# EAGLE design EspWifiMk2 (EAGLE 8.0.0)
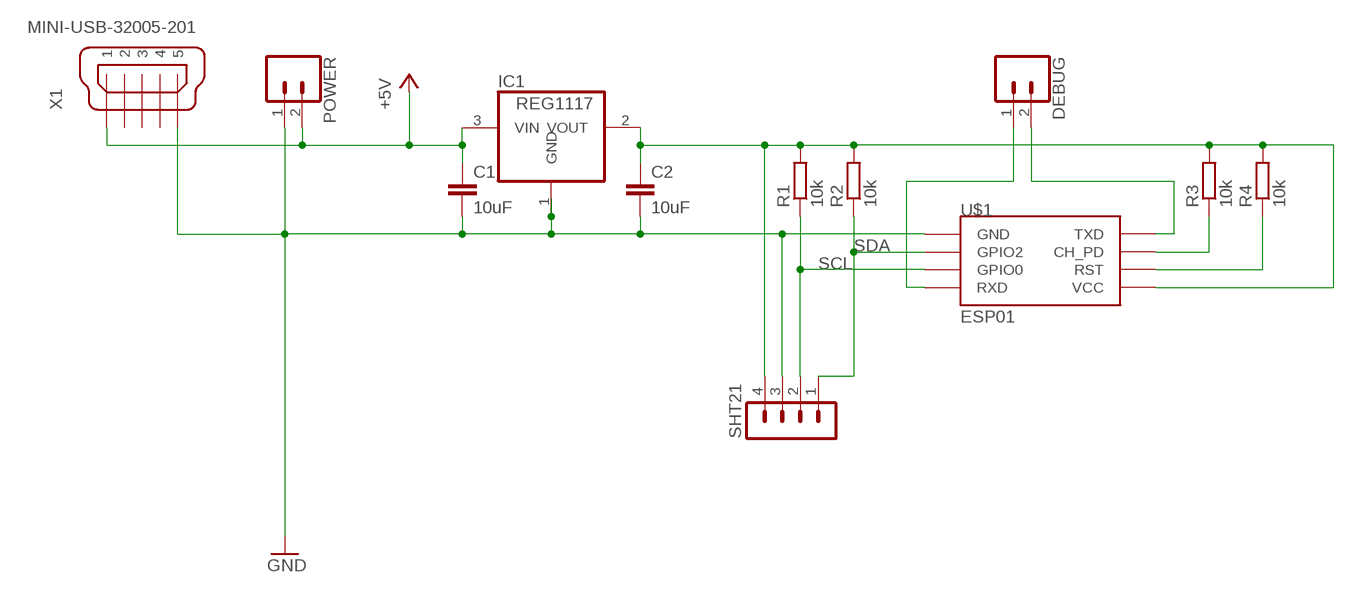
[diagram p0: schematic, sheet 1]

## Parts
C1  10uF  C-EUC1206  [C1206]
C2  10uF  C-EUC1206  [C1206]
DEBUG  CONN_02  [1X02]
IC1  REG1117  [SOT223]
POWER  CONN_02  [1X02]
R1  10k  R-EU_M1206  [M1206]
R2  10k  R-EU_M1206  [M1206]
R3  10k  R-EU_M1206  [M1206]
R4  10k  R-EU_M1206  [M1206]
SHT21  MA04-1  [MA04-1]
U$1  ESP01  [ESP01]
X1  MINI-USB-32005-201  [32005-201]

## Nets
3V3: C2.1 IC1.2(VOUT) R1.2 R2.2 R3.2 R4.2 SHT21.4 U$1.VCC
+5V: C1.1 IC1.3(VIN) POWER.2 X1.1
GND: C1.2 C2.2 IC1.1(GND) POWER.1 SHT21.3 U$1.GND X1.5
N$1: R3.1 U$1.CH_PD
N$2: R4.1 U$1.RST
N$3: DEBUG.1 U$1.RX(RXD)
N$4: DEBUG.2 U$1.TX(TXD)
SCL: R1.1 SHT21.2 U$1.GPIO0
SDA: R2.1 SHT21.1 U$1.GPIO2
Unconnected: X1.2 X1.3 X1.4

## Library data of the parts
C1 C2 = rcl:C-EU: CAPACITOR, European symbol
DEBUG POWER = SparkFun-Retired:CONN_02: Multi connection point. Often used as Generic Header-pin footprint for 0.1 inch spaced/style header connections On any of the 0.1 inch spaced packages, you can populate with these: Break Away Headers - Straight <https://www.sparkfun.com/products/116> (PRT-00116) Break Away Male Headers - Right Angle <https://www.sparkfun.com/products/553> (PRT-00553) Female Headers <https://www.sparkfun.com/products/115> (PRT-00115) Break Away Headers - Machine Pin <https://www.sparkfun.com/products/117> (PRT-00117) Break Away Female Headers - Swiss Machine Pin <https://www.sparkfun.com/products/743> (PRT-00743) For SCREWTERMINALS and SPRING TERMINALS visit here: Screw Terimnals on SparkFun.com <https://www.sparkfun.com/search/results?term=Screw+Terminals> (5mm/3.5mm/2.54mm spacing) This device is also useful as a general connection point to wire up your design to another part of your project. Our various solder wires solder well into these plated through hole pads. Hook-Up Wire - Assortment (Stranded, 22 AWG) <https://www.sparkfun.com/products/11375> (PRT-11375) Hook-Up Wire - Assortment (Solid Core, 22 AWG) <https://www.sparkfun.com/products/11367> (PRT-11367) View the entire wire category on our website here <https://www.sparkfun.com/categories/141> Special notes: Molex polarized connector foot print use with: PRT-08233 with associated crimp pins and housings. 2.54_SCREWTERM for use with PRT-10571. 3.5mm Screw Terminal footprints for PRT-08084 5mm Screw Terminal footprints for use with PRT-08432
IC1 = burr-brown:REG1117: 800mA and 1A Low Dropout (LDO) Positive Regulator 1.8V, 2.5V, 2.85V, 3.3V, 5V, and Adj; MPN: REG1117; OC_FARNELL: 1097566; OC_NEWARK: 14P6981
R1-R4 = resistor:R-EU_: RESISTOR, European symbol
SHT21 = con-lstb:MA04-1: PIN HEADER; OC_FARNELL: unknown; OC_NEWARK: unknown
U$1 = esp8266modules:ESP01: ESP8266 Wifi module 01
X1 = con-cypressindustries:MINI-USB-: MINI USB-B Conector Source: www.cypressindustries.com; OC_FARNELL: unknown; OC_NEWARK: unknown

## Board
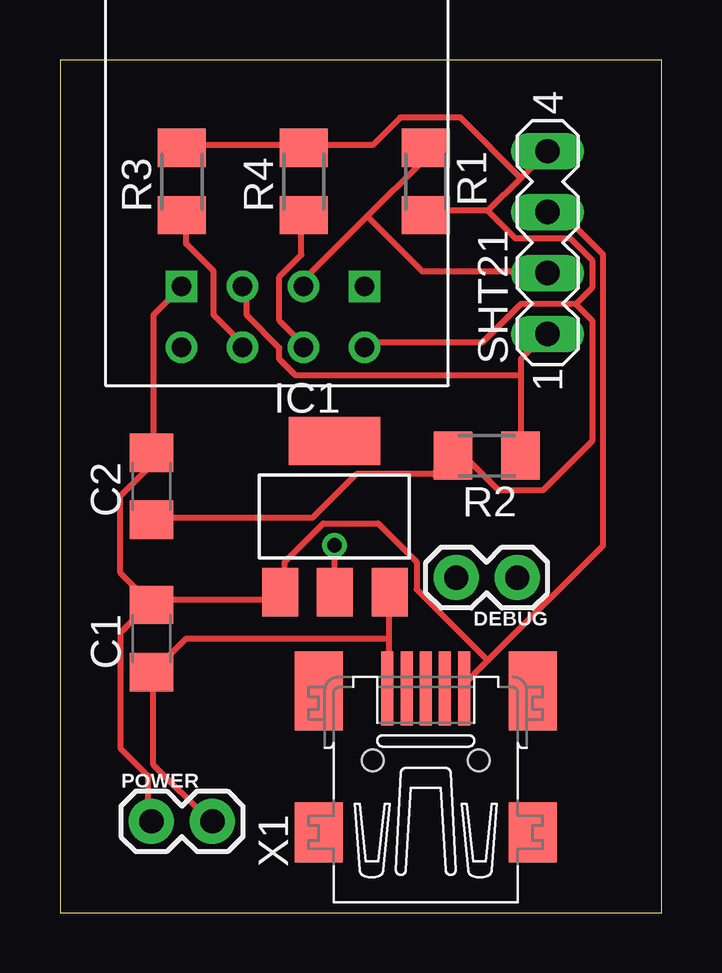
[diagram p1: board, top side]
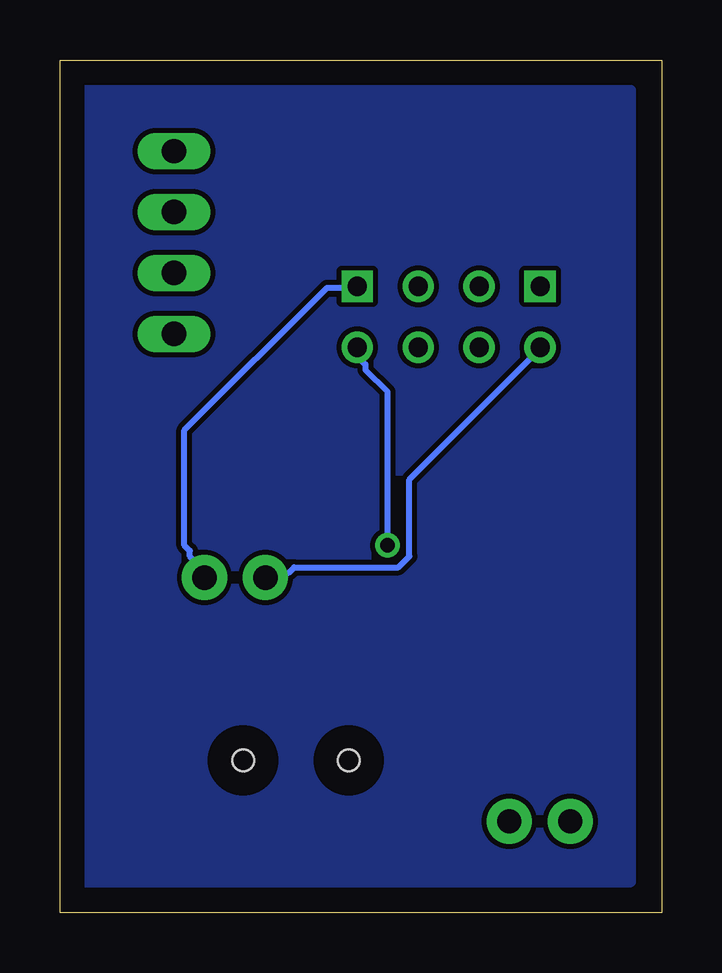
[diagram p2: board, bottom side, seen from below]

Size 25.07 x 35.55 mm. Coordinates in mm from the lower left corner, seen from the top.
Outline: 0,0 25.07,0 25.07,35.55 0,35.55 0,0
Copper layers (1*16): Top 0.035mm / dielectric 1.5mm / Bottom 0.035mm
Design rules "default": minimum track width 10mil, minimum drill 24mil, track to track 8mil, track to pad 8mil, pad to pad 8mil, via to via 8mil, smd to smd 8mil, copper to edge 40mil, drill to drill 8mil, minimum pad ring 10mil, minimum via ring 8mil, stop-mask expansion 4mil, vias tented up to drill 0mil, thermal gap 10mil

### Footprints (pad centres in the part's own frame; a part is rotated, then mirrored left to right if it is on the bottom)
C1206 = smd 1.6 x 1.8: 1 -1.4,0; 2 1.4,0
1X02 = drill 1.016 pad 1.88: 1 0,0; 2 2.54,0
SOT223 = smd 1.499 x 2.007: 1 -2.261,-3.15; 2 0.025,-3.15; 3 2.311,-3.15 | smd 3.81 x 2.007: 4 0,3.15
M1206 = smd 1.6 x 2: 1 -1.4,0; 2 1.4,0
MA04-1 = drill 1.016 long: 1 -3.81,0; 2 -1.27,0; 3 1.27,0; 4 3.81,0
ESP01 = drill 0.8: CH_PD -1.285,-8.178; GPIO0 1.255,-5.638; GPIO2 -1.285,-5.638; RST 1.255,-8.178; TX -3.825,-8.178; VCC 3.795,-8.178 | drill 0.8 square: GND -3.825,-5.638; RX 3.795,-5.638
32005-201 = smd 3.1 x 0.5: 1 3,1.6; 2 3,0.8; 3 3,0; 4 3,-0.8; 5 3,-1.6 | smd 2.5 x 2: M1 -3,-4.45; M2 -3,4.45 | smd 3.3 x 2: M3 2.9,4.45; M4 2.9,-4.45 | hole 0.9: 0,2.2; 0,-2.2

### Placement (x,y rotation side)
C1  3.81,11.43 90 top
C2  3.81,17.78 90 top
DEBUG  19.05,13.97 180 top
IC1  11.43,16.51 0 top
POWER  3.81,3.81 0 top
R1  15.24,30.48 270 top
R2  17.78,19.05 180 top
R3  5.08,30.48 90 top
R4  10.16,30.48 90 top
SHT21  20.32,27.94 90 top
U$1  8.89,31.75 0 top
X1  15.24,6.35 90 top

### Tracks (layer width: path | path; a pad name or v marks a point on that pad's centre or on a via)
3V3  (via drill 0.61)
  Top 0.254: C2.1 3.89,16.46 10.52,16.46 12.34,18.29 15.54,18.29 16.23,18.97 R2.2 16.46,18.97 16.92,18.97 18.29,17.6 20.12,17.6 22.17,19.66 22.17,24.69 21.49,25.38 | v11.43,15.32 11.43,13.49 IC1.2 | R3.2 5.26,32 10.06,32 R4.2 10.29,32 13.03,32 14.17,33.15 16.69,33.15 19.2,30.63 | 17.83,29.26 15.32,29.26 R1.2 | SHT21.4 19.2,30.63 | 19.2,30.63 17.83,29.26 | 21.49,25.38 19.2,25.38 17.6,23.77 12.8,23.77 U$1.VCC | 21.49,25.38 22.17,26.06 22.17,27.2 21.26,28.12 18.97,28.12 17.83,29.26
  Bottom 0.254: v11.43,15.32 11.43,21.72 12.34,22.63 12.34,22.86 12.57,23.09 12.57,23.55 U$1.VCC
+5V
  Top 0.254: 13.72,11.43 13.72,9.37 X1.1 | 13.72,11.43 13.72,13.26 IC1.3 | POWER.2 6.17,3.89 3.89,6.17 3.89,9.83 C1.1 3.89,10.06 5.26,11.43 13.72,11.43
GND
  Top 0.254: 17.83,10.52 16.69,9.37 X1.5 | 17.83,10.52 22.63,15.32 22.63,27.43 21.03,29.03 20.34,29.03 SHT21.3 | U$1.GND 5.03,26.06 3.89,24.92 3.89,19.2 C2.2 3.66,18.97 3.66,18.52 2.52,17.37 2.52,14.17 3.66,13.03 C1.2 | C1.2 3.89,13.03 8.91,13.03 9.14,13.26 IC1.1 9.37,13.49 9.37,14.63 10.97,16.23 13.26,16.23 14.86,14.63 14.86,13.49 17.83,10.52 | POWER.1 3.66,3.89 3.66,5.71 2.52,6.86 2.52,11.66 3.66,12.8 C1.2
N$1
  Top 0.254: R3.1 5.26,29.03 5.26,27.89 6.4,26.75 6.4,24.92 7.54,23.77 U$1.CH_PD
N$2
  Top 0.254: R4.1 10.06,29.03 10.06,27.43 9.14,26.52 9.14,24.69 10.06,23.77 U$1.RST
N$3
  Bottom 0.254: U$1.RX 12.8,26.06 13.95,26.06 19.89,20.12 19.89,15.32 19.66,15.09 19.66,14.86 18.97,14.17 DEBUG.1
N$4
  Bottom 0.254: U$1.TX 5.26,23.55 5.26,23.32 10.52,18.06 10.52,14.86 10.97,14.4 15.32,14.4 15.54,14.17 16.46,14.17 DEBUG.2
N$5
  pour Bottom: 1.27,34.29 24.13,34.29 24.13,1.27 1.27,1.27
SCL
  Top 0.254: 12.8,29.03 10.06,26.29 U$1.GPIO0 | 12.8,29.03 15.09,31.32 15.09,31.77 R1.1 | 12.8,29.03 15.09,26.75 20.12,26.75 SHT21.2
SDA
  Top 0.254: 19.2,22.4 19.2,23.09 20.12,24 SHT21.1 | 19.2,22.4 19.2,19.2 R2.1 | 19.2,22.4 9.83,22.4 9.14,23.09 9.14,23.55 7.77,24.92 7.77,26.06 U$1.GPIO2